# Altium project DC_DC_Converter_FPMI_Lab.PrjPcb
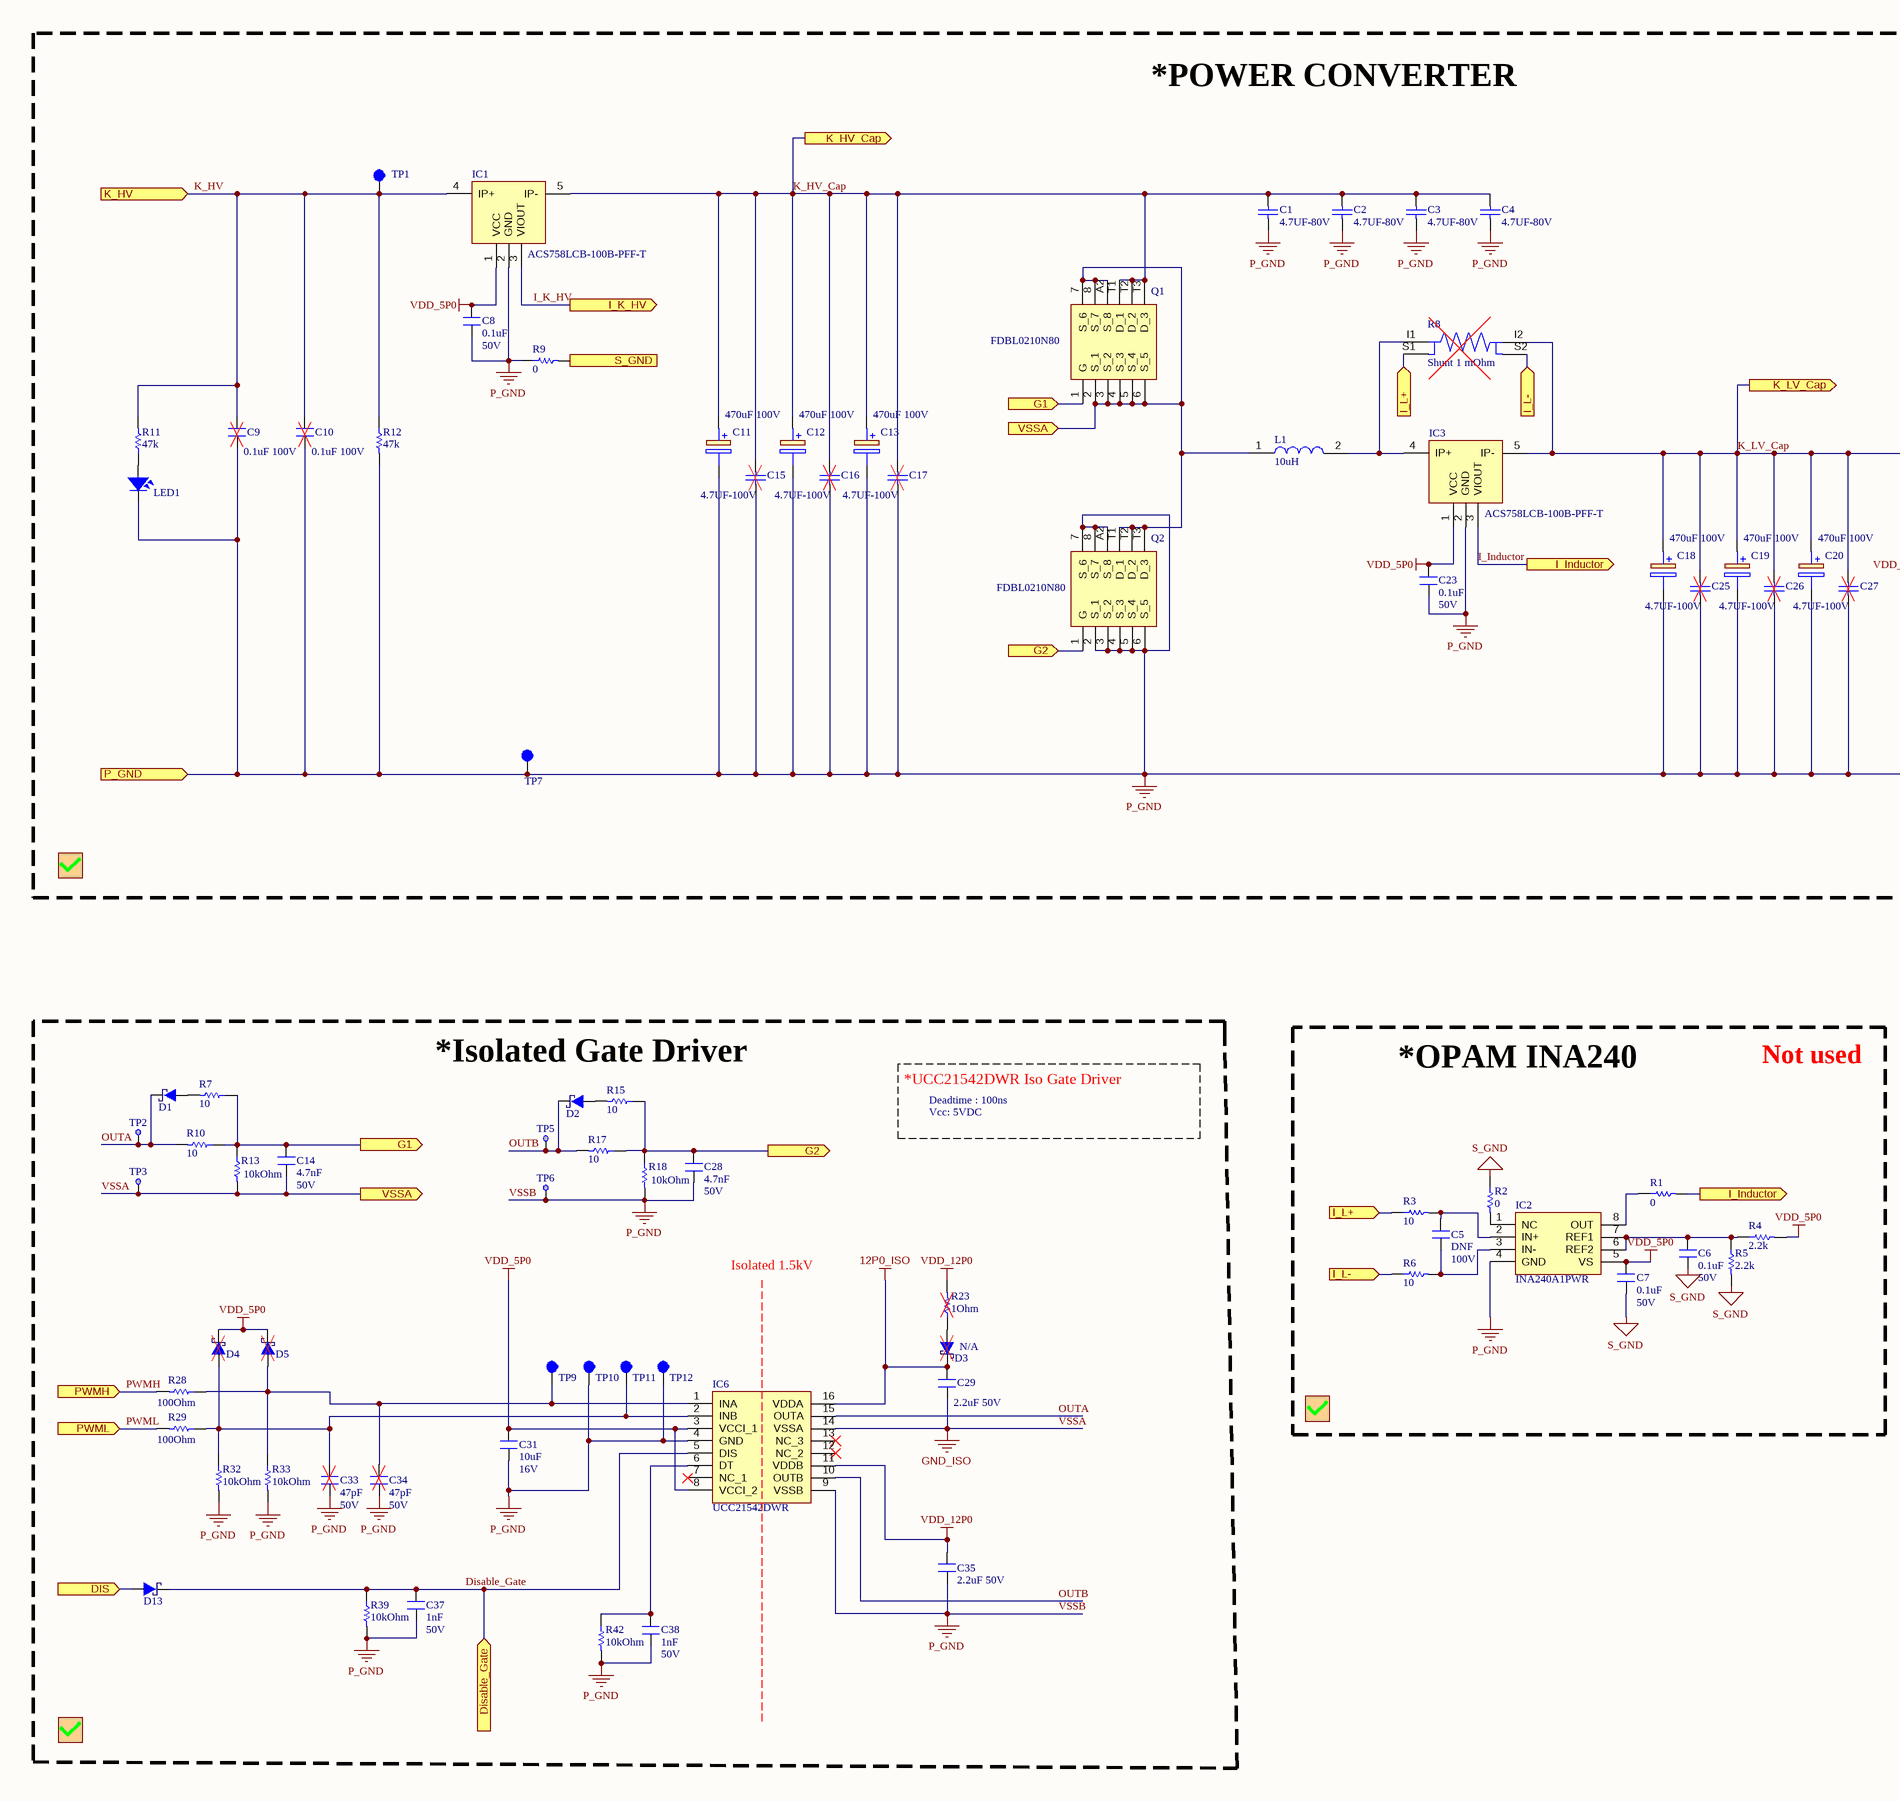
[diagram p0: Power Stages.SchDoc, left]
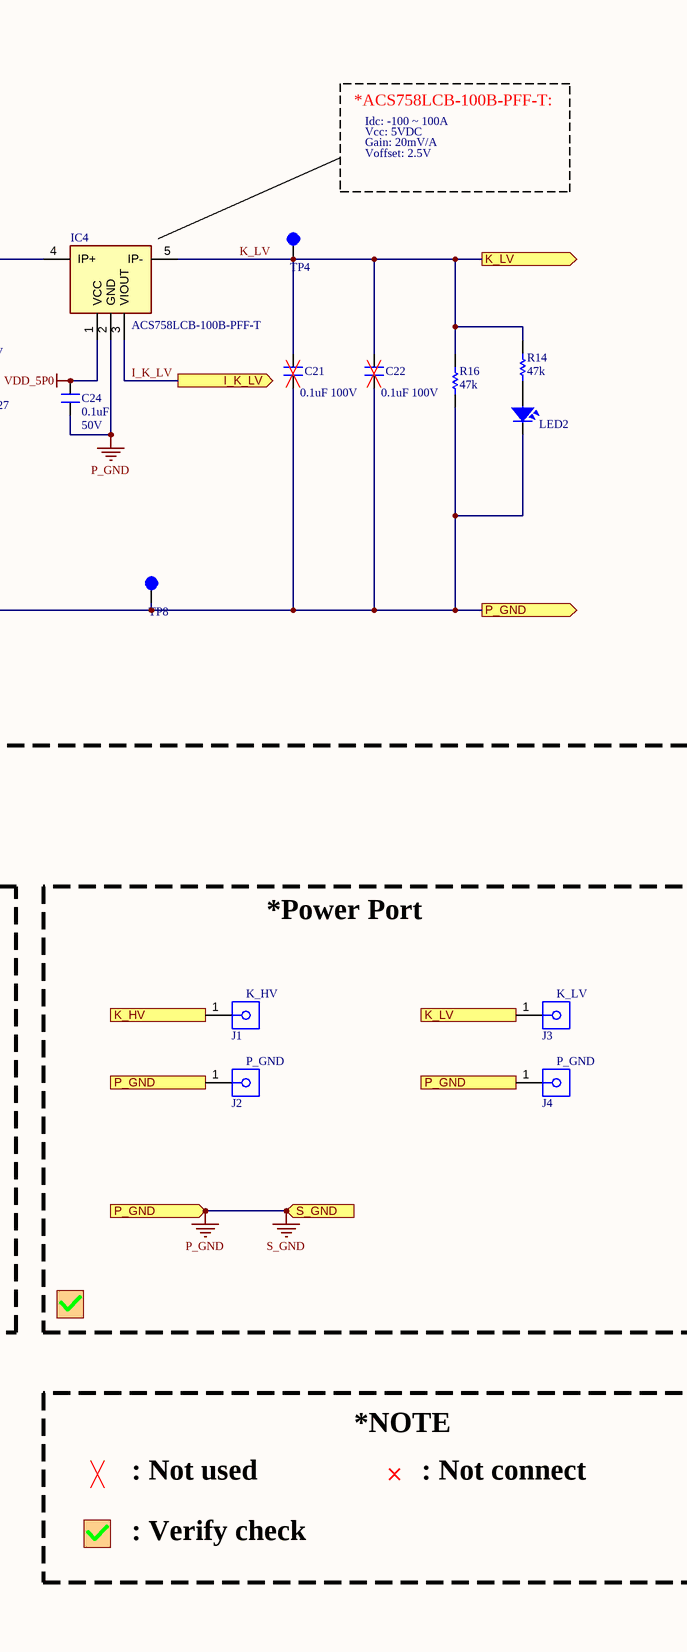
[diagram p1: Power Stages.SchDoc, right]
3 sheets, 200 parts. Net scope: flat (ports and power ports of the same name join across sheets).
Board file: DC_DC_Converter_PCB.PcbDoc
Sheets:
  Power Stages.SchDoc
  Sensor Signal.SchDoc
  Power Supply.SchDoc

## Sheet Power Stages.SchDoc
size A2; SheetNumber: 1; SheetTotal: 3

### Parts
C1  value 4.7UF-80V  [C_1210]  (hidden comment: GRM32ER71K475KE14L)
C2  value 4.7UF-80V  [C_1210]  (hidden comment: GRM32ER71K475KE14L)
C3  value 4.7UF-80V  [C_1210]  (hidden comment: GRM32ER71K475KE14L)
C4  value 4.7UF-80V  [C_1210]  (hidden comment: GRM32ER71K475KE14L)
C5  DNF  value 100V  [C_0603]
C6  0.1uF  value 50V  [C_0603]
C7  0.1uF  value 50V  [C_0603]
C8  0.1uF  value 50V  [C_0603]
C9  0.1uF 100V  [C_1206]
C10  0.1uF 100V  [C_1206]
C11  470uF 100V  [CAP-ALU-13MM*30MM]
C12  470uF 100V  [CAP-ALU-13MM*30MM]
C13  470uF 100V  [CAP-ALU-13MM*30MM]
C14  4.7nF  value 50V  [C_0603]
C15  value 4.7UF-100V  [C_1210]  (hidden comment: GRM32ER71K475KE14L)
C16  value 4.7UF-100V  [C_1210]  (hidden comment: GRM32ER71K475KE14L)
C17  value 4.7UF-100V  [C_1210]  (hidden comment: GRM32ER71K475KE14L)
C18  470uF 100V  [CAP-ALU-13MM*30MM]
C19  470uF 100V  [CAP-ALU-13MM*30MM]
C20  470uF 100V  [CAP-ALU-13MM*30MM]
C21  0.1uF 100V  [C_1206]
C22  0.1uF 100V  [C_1206]
C23  0.1uF  value 50V  [C_0603]
C24  0.1uF  value 50V  [C_0603]
C25  value 4.7UF-100V  [C_1210]  (hidden comment: GRM32ER71K475KE14L)
C26  value 4.7UF-100V  [C_1210]  (hidden comment: GRM32ER71K475KE14L)
C27  value 4.7UF-100V  [C_1210]  (hidden comment: GRM32ER71K475KE14L)
C28  4.7nF  value 50V  [C_0603]
C29  2.2uF 50V  [C_1206]
C31  10uF  value 16V  [C_0805]
C33  47pF  value 50V  [C_0603]
C34  47pF  value 50V  [C_0603]
C35  2.2uF 50V  [C_1206]
C37  1nF  value 50V  [C_0603]
C38  1nF  value 50V  [C_0603]
D1  B0520WS-7-F  [SOD323F]  (value not drawn)
D2  B0520WS-7-F  [SOD323F]  (value not drawn)
D3  PMEG2010AEJ,115  [SOD123]  (value not drawn)
D4  PMEG2010AEJ,115  [SOD323F]  (value not drawn)
D5  PMEG2010AEJ,115  [SOD323F]  (value not drawn)
D13  PMEG2010AEJ,115  [SOD323F]  (value not drawn)
IC1  ACS758LCB-100B-PFF-T  [ACS772ECB200BPFFT]
IC2  INA240A1PWR  [SOP65P640X120-8N]
IC3  ACS758LCB-100B-PFF-T  [ACS772ECB200BPFFT]
IC4  ACS758LCB-100B-PFF-T  [ACS772ECB200BPFFT]
IC6  UCC21542DWR  [SOIC127P1030X265-16N]
J1  K_HV  [HOLE_5mm_RED]
J2  P_GND  [HOLE_5mm_BLACK]
J3  K_LV  [HOLE_5mm_RED]
J4  P_GND  [HOLE_5mm_BLACK]
L1  10uH  [CSCF3218-6R8MC]
LED1  LED SMD  [SM-LED-0805-Blue]  (value not drawn)
LED2  LED SMD  [SM-LED-0805-Blue]  (value not drawn)
Q1  FDBL0210N80  [NTBLS1D5N10MC - duplicate]
Q2  FDBL0210N80  [NTBLS1D5N10MC - duplicate]
R1  0  [R_0603]
R2  0  [R_0603]
R3  10  [R_0603]
R4  2.2k  [R_0603]
R5  2.2k  [R_0603]
R6  10  [R_0603]
R7  10  [R_0805]
R8  Shunt 1 mOhm  [PSG4/PSF4]
R9  value 0  [R_0603]  (hidden comment: 0603)
R10  10  [R_0805]
R11  47k  [R_0603]
R12  47k  [R_1206]
R13  value 10kOhm  [R_0603]  (hidden comment: 0603)
R14  47k  [R_0603]
R15  10  [R_0805]
R16  47k  [R_1206]
R17  10  [R_0805]
R18  value 10kOhm  [R_0603]  (hidden comment: 0603)
R23  value 1Ohm  [R_0603]  (hidden comment: 0603)
R28  value 100Ohm  [R_0603]  (hidden comment: 0603)
R29  value 100Ohm  [R_0603]  (hidden comment: 0603)
R32  value 10kOhm  [R_0603]  (hidden comment: 0603)
R33  value 10kOhm  [R_0603]  (hidden comment: 0603)
R39  value 10kOhm  [R_0603]  (hidden comment: 0603)
R42  value 10kOhm  [R_0603]  (hidden comment: 0603)
TP1  Test Point  [TP_1mm_through_hole]  (value not drawn)
TP2  TP  [TP_1mm]  (value not drawn)  (no BOM)
TP3  TP  [TP_1mm]  (value not drawn)  (no BOM)
TP4  Test Point  [TP_1mm_through_hole]  (value not drawn)
TP5  TP  [TP_1mm]  (value not drawn)  (no BOM)
TP6  TP  [TP_1mm]  (value not drawn)  (no BOM)
TP7  Test Point  [TP_1mm_through_hole]  (value not drawn)
TP8  Test Point  [TP_1mm_through_hole]  (value not drawn)
TP9  Test Point  [TP_1mm_through_hole]  (value not drawn)
TP10  Test Point  [TP_1mm_through_hole]  (value not drawn)
TP11  Test Point  [TP_1mm_through_hole]  (value not drawn)
TP12  Test Point  [TP_1mm_through_hole]  (value not drawn)

### Blocks framed on the sheet
*POWER CONVERTER: C1-C4 C8-C13 C15-C27 IC1 IC3 IC4 L1 LED1 LED2 Q1 Q2 R8 R9 R11 R12 R14 R16 TP1 TP4 TP7 TP8
*Isolated Gate Driver: C14 C28 C29 C31 C33-C35 C37 C38 D1-D5 D13 IC6 R7 R10 R13 R15 R17 R18 R23 R28 R29 R32 R33 R39 R42 TP2 TP3 TP5 TP6 TP9-TP12
*OPAM INA240: C5-C7 IC2 R1-R6
*Power Port: J1-J4

### Ports
DIS (in), Disable_Gate (in), G1 (in), G1 (out), G2 (in), G2 (out), I_Inductor (out), I_K_HV (out), I_K_LV (out), I_L+ (in), I_L- (in), K_HV (in), K_HV_Cap (out), K_LV (in), K_LV (out), K_LV_Cap (out), P_GND (in), P_GND (out), PWMH (in), PWML (in), S_GND (in), S_GND (out), VSSA (in), VSSA (out)

### Nets
12P0_ISO: C29.2 D3.2 IC6.16(VDDA)
VDD_5P0: C7.1 C8.2 C23.2 C24.2 C31.2 D4.2 D5.2 IC1.1(VCC) IC2.5(VS) IC3.1(VCC) IC4.1(VCC) IC6.3(VCCI_1) IC6.8(VCCI_2) R4.1
VDD_12P0: C35.1 IC6.11(VDDB) R23.1
VSSA: C14.1 C29.1 IC6.14(VSSA) L1.1 Q1.2(S_1) Q1.3(S_2) Q1.4(S_3) Q1.5(S_4) Q1.6(S_5) Q1.7(S_6) Q1.8(S_7) Q1.A2(S_8) Q2.T1(D_1) Q2.T2(D_2) Q2.T3(D_3) R13.1 TP3.1(TP) ; port VSSA  [also labelled GND_ISO]
VSSB: C1.1 C2.1 C3.1 C4.1 C6.1 C7.2 C8.1 C9.1 C10.1 C11.2(-) C12.2(-) C13.2(-) C15.1 C16.1 C17.1 C18.2(-) C19.2(-) C20.2(-) C21.1 C22.1 C23.1 C24.1 C25.1 C26.1 C27.1 C28.1 C31.1 C33.2 C34.2 C35.2 C37.1 C38.1 IC1.2(GND) IC2.4(GND) IC3.2(GND) IC4.2(GND) IC6.4(GND) IC6.9(VSSB) J2.1 J4.1 LED1.2 LED2.2 Q2.2(S_1) Q2.3(S_2) Q2.4(S_3) Q2.5(S_4) Q2.6(S_5) Q2.7(S_6) Q2.8(S_7) Q2.A2(S_8) R2.2 R5.1 R9.1 R9.2 R12.1 R16.1 R18.1 R32.1 R33.1 R39.1 R42.1 TP6.1(TP) TP7.1(B) TP8.1(B) TP10.1(B) TP12.1(B) ; port P_GND, port S_GND  [also labelled P_GND, S_GND]
Disable_Gate: C37.2 D13.2 IC6.5(DIS) R39.2 ; port Disable_Gate
I_Inductor: IC3.3(VIOUT) R1.1 ; port I_Inductor
I_K_HV: IC1.3(VIOUT) ; port I_K_HV
I_K_LV: IC4.3(VIOUT) ; port I_K_LV
K_HV: C9.2 C10.2 IC1.4(IP+) J1.1 R11.1 R12.2 TP1.1(B) ; port K_HV
K_HV_Cap: C1.2 C2.2 C3.2 C4.2 C11.1(+) C12.1(+) C13.1(+) C15.2 C16.2 C17.2 IC1.5(IP-) Q1.T1(D_1) Q1.T2(D_2) Q1.T3(D_3) ; port K_HV_Cap
K_LV: C21.2 C22.2 IC4.5(IP-) J3.1 R14.1 R16.2 TP4.1(B) ; port K_LV
K_LV_Cap: C18.1(+) C19.1(+) C20.1(+) C25.2 C26.2 C27.2 IC3.5(IP-) IC4.4(IP+) R8.I2 ; port K_LV_Cap
OUTA: D1.2 IC6.15(OUTA) R10.1 TP2.1(TP)
OUTB: D2.2 IC6.10(OUTB) R17.1 TP5.1(TP)
PWMH: R28.1 ; port PWMH
PWML: R29.1 ; port PWML
NetC5_1: C5.1 IC2.2(IN+) R3.1
NetC5_2: C5.2 IC2.3(IN-) R6.1
NetC6_2: C6.2 IC2.6(REF2) IC2.7(REF1) R4.2 R5.2
NetC14_2: C14.2 Q1.1(G) R7.2 R10.2 R13.2 ; port G1
NetC28_2: C28.2 Q2.1(G) R15.2 R17.2 R18.2 ; port G2
NetC33_1: C33.1 D4.1 IC6.2(INB) R29.2 R32.2 TP11.1(B)
NetC34_1: C34.1 D5.1 IC6.1(INA) R28.2 R33.2 TP9.1(B)
NetC38_2: C38.2 IC6.6(DT) R42.2
NetD1_1: D1.1 R7.1
NetD2_1: D2.1 R15.1
NetD3_1: D3.1 R23.2
NetD13_1: D13.1 ; port DIS
NetIC2_1: IC2.1(NC) R2.1
NetIC2_8: IC2.8(OUT) R1.2
NetIC3_4: IC3.4(IP+) L1.2 R8.I1
NetLED1_1: LED1.1 R11.2
NetLED2_1: LED2.1 R14.2
NetR3_2: R3.2 R8.S1 ; port I_L+
NetR6_2: R6.2 R8.S2 ; port I_L-

Not connected (* = marked no-connect by the designer): IC6 7(NC_1)* 12(NC_2)* 13(NC_3)*

### Notes on the sheet
- *ACS758LCB-100B-PFF-T:
- Idc: -100 ~ 100A
- Voffset: 2.5V
- Gain: 20mV/A
- Vcc: 5VDC
- *UCC21542DWR Iso Gate Driver
- Deadtime : 100ns
- Not used
- Isolated 1.5kV
- (near D3) N/A
- *NOTE
- : Not used
- : Not connect
- : Verify check
- Title:
- Project:
- Power Converter Module
- DC/DC Bidirectional Converter
- Revision:
- CLA Power Electronics
- 36 Xuan Thuy, Dich Vong Hau
- Draw:
- File Name:
- AnhDT
- Check:
- Approve:
- Sheet:
- 1
- Size:
- of
- A2
- Modified Date:
- Cau Giay - Ha Noi
- Time:
- Date:
- ©2023

### Library data of the parts
C1-C4 C15-C17 C25-C27 = Cap 1210: CAP CER 4.7uF 80V X7R 1210; Manufacturer: TDK Corporation; Description std: CAP CER 4.7UF 100V X7S 1210; Category: Capacitors; Part Number: GRM32ER71K475KE14L; Link: https://www.digikey.com/product-detail/en/tdk-corporation/C3225X7S2A475M200AB/445-6043-2-ND/2443521; Digikey Price/1KU: 0.56250; Package: 1210; Digikey Price/1unit: 1.64
C5 = Cap_Cer_0603_1nF: Manufacturer: Murata Electronics; Part Number: GCM188R71E102KA37D; Part Code: S1200-000081; Description SEL: CAP CER 1000PF 25V X7R 0603; Point: 2; Footprint Type: SMD
C6 C7 = Cap_Cer_0603_1nF: CAP CER 0.1UF 50V X7R 0603; Manufacturer: Murata Electronics; Part Number: GCM188R71E102KA37D; Part Code: S1200-000081; Description SEL: CAP CER 1000PF 25V X7R 0603; Point: 2; Footprint Type: SMD
C8 C23 C24 = Cap_Cer_0603_1nF_25V: CAP CER 0.1UF 16V X5R 0603; Manufacturer: Murata Electronics; Part Number: CL21A106KOCLRNC; Part Code: S1200-000082; Description SEL: CAP CER 10UF 16V X5R 0805; Point: 2; Footprint Type: SMD
C9 C10 C21 C22 C29 C35 = Cap_Cer_1206_1uF: Ceramic Capacitor 1206 (+-10% TH)/(+10%SMD); Manufacturer: TDK Corporation; Part Number: C3216X7R2A105K160AA; Part Code: S1200-000129; Description SEL: CAP CER 1UF 100V X7R 1206; Point: 2; Footprint Type: SMD
C11-C13 C18-C20 = 100ZLH470MEFC16X31.5: CAP ALUM 470UF 20% 80V RADIAL; Manufacturer_Name: Panasonic Electronic Components; Part Number: EEU-FS1K471L; Value: 470uF 80V; Height: 33.5mm; Mouser Part Number: EEU-FS1K471L; Mouser Price/Stock: https://www.digikey.com/en/products/detail/panasonic-electronic-components/EEU-FS1K471L/9597020; Arrow Part Number: EEU-FS1K471L; Arrow Price/Stock: https://www.arrow.com/en/products/100zlh470mefc16x31.5/rubycon?region=nac
C14 C28 = Cap_Cer_0603_1nF_25V: CAP CER 0805 4.7NF 50V C0G 5%; Manufacturer: KEMET; Part Number: C0805C472J5GECAUTO; Part Code: S1200-000082; Point: 2; Description SEL: CAP CER 0805 4.7NF 50V C0G 5%; Footprint Type: SMD
C31 = Cap_Cer_0805_10pF: CAP CER 10uF 16V X7R 0805; Manufacturer: Kemet; Part Number: CL21A106KOCLRNC; Part Code: S1200-000116; Point: 2; Description SEL: CAP CER 10uF 16V X7R 0805; Footprint Type: SMD
C33 C34 C37 C38 = Cap_Cer_0603_1nF_25V: CAP CER 1nF 50V X7R 0603; Manufacturer: Murata Electronics; Part Number: GCM188R71E102KA37D; Part Code: S1200-000082; Description SEL: CAP CER 1000PF 25V X7R 0603; Point: 2; Footprint Type: SMD
D1-D3 D13 = PMEG2010AEJ,115: DIODE SCHOTTKY 20V 1A SOD323F; Manufacturer: Nexperia USA Inc.; Current: 1A (DC); Category: DIODE; Part Number: PMEG2010AEJ,115; Footprint/Package: SOD-323F; Footprint type: SMD; Voltage: 20 V
D4 D5 = PMEG2010AEJ,115: DIODE SCHOTTKY 30V 0.2A SOD323F; Manufacturer: Nexperia USA Inc.; Part Number: BAT54HT1G; Current: 0.2A (DC); Voltage: 20 V; Category: DIODE; Footprint/Package: SOD-323F; Footprint type: SMD
IC1 IC3 IC4 = ACS758LCB-100B-PFF-T: Integrated Circuit; Manufacturer_Name: Allegro Microsystems; Datasheet Link: https://www.allegromicro.com/-/media/files/datasheets/acs758-datasheet.ashx; Height: 7.1mm; Manufacturer_Part_Number: ACS758LCB-100B-PFF-T; Mouser Part Number: 250-758LCB100BPFFT; Mouser Price/Stock: https://www.mouser.co.uk/ProductDetail/Allegro-MicroSystems/ACS758LCB-100B-PFF-T?qs=pUKx8fyJudA0WtlqV%2Fcrcw%3D%3D; Arrow Part Number: ACS758LCB-100B-PFF-T; Arrow Price/Stock: https://www.arrow.com/en/products/acs758lcb-100b-pff-t/allegro-microsystems?region=nac
IC2 = INA240A1PWR: Integrated Circuit; Manufacturer_Name: Texas Instruments; Datasheet Link: http://www.ti.com/lit/gpn/INA240; Height: 1.2mm; Manufacturer_Part_Number: INA240A1PWR; Mouser Part Number: 595-INA240A1PWR; Mouser Price/Stock: https://www.mouser.co.uk/ProductDetail/Texas-Instruments/INA240A1PWR?qs=aVyJF2WnouTDXnRi6tpqfA%3D%3D; Arrow Part Number: INA240A1PWR; Arrow Price/Stock: https://www.arrow.com/en/products/ina240a1pwr/texas-instruments?region=nac
IC6 = UCC21542DWR: REINFORCED ISOLATION DUAL-CHANNE; Manufacturer_Name: Texas Instruments; Datasheet Link: https://www.ti.com/lit/ds/symlink/ucc21542.pdf?ts=1623395410745&ref_url=https%253A%252F%252Fwww.ti.com%252Fstore%252Fti%252Fen%252Fp%252Fproduct%252F%253Fp%253DUCC21542DWKR; Height: 2.65mm; Part Number: UCC21542DWR; Mouser Part Number: 595-UCC21542DWR; Mouser Price/Stock: https://www.mouser.co.uk/ProductDetail/Texas-Instruments/UCC21542DWR?qs=DRkmTr78QARxjB5fL7Hhaw%3D%3D
J1-J4 = CONN_1P: Electric Pole 1; Footprint type: TH; Footprint/Package: Nonstandard
L1 = IHDF1300AEEH4R7K10: 10-µH with a specified saturation current of 70-A DC; Height: 15.4mm
LED1 LED2 = LED-SMD-0805: LED BLUE 1/4W 0805
Q1 Q2 = IPLU300N04S4R8XTMA1: MOSFET N-CH 80V 240A 8HPSOF; Manufacturer_Name: Infineon; Height: 2.3mm; Part Number: FDBL0210N80; Mouser Part Number: FDBL0210N80; Arrow Part Number: IPLU300N04S4R8XTMA1
R1 R2 = Resistor_0603_10Ohm 1%: RES 0 OHM 1% 1/8W 0603; Manufacturer: KOA Speer Electronics, Inc.; Part Number: RK73H1JRTTD10R0F; Part Code: S1100-000044; Description SEL: RES 10 OHM 1% 1/8W 0603; Point: 2; Value: 8.2-10kOhm; Footprint Type: SMD; Power: 1/8W; Tolerance: 1%
R3 R6 = Resistor_0603_10Ohm 1%: RES 10 OHM 1% 1/8W 0603; Manufacturer: KOA Speer Electronics, Inc.; Part Number: RK73H1JRTTD10R0F; Part Code: S1100-000044; Point: 2; Description SEL: RES 10 OHM 1% 1/8W 0603; Footprint Type: SMD; Power: 1/8W; Tolerance: 1%
R4 R5 = Resistor_0603_10Ohm 1%: RES 2.2k OHM 1% 1/8W 0603; Manufacturer: KOA Speer Electronics, Inc.; Part Number: RK73H1JRTTD10R0F; Part Code: S1100-000044; Description SEL: RES 10 OHM 1% 1/8W 0603; Point: 2; Footprint Type: SMD; Power: 1/8W; Tolerance: 1%
R7 R10 R15 R17 = Resistor_0805_10Ohm: RES 10 OHM 1% 1/8W 0805; Part Number: RE0805FRE0710RL; Manufacturer: YAGEO; Part Code: S1100-000072; Description SEL: RES SMD 10 OHM 1% 1/8W 0805; Point: 2; Footprint Type: SMD; Power: 1/8W; Tolerance: 1%
R8 = PSG4NTEBL500F: RES 1m OHM 1% 10W NONSTANDARD; Manufacturer: KOA Speer Electronics, Inc.; Value: 1 mOhm; Part Number: PSG4NTEBL500F; Footprint/Package: Nonstandard; Footprint type: SMD; Tolerance: ±1%; Category: Resistor
R9 = Resistor_0603_10kOhm 1%: RES 0 OHM 1% 1/10W 0603; Manufacturer: YAGEO; Part Number: RC0603FR-7W10KL; Part Code: S1100-000043; Description SEL: RES 10K OHM 1% 1/10W 0603; Point: 2; Footprint Type: SMD; Power: 1/10W; Tolerance: 1%
R11 R14 = Resistor_0603_10Ohm 1%: RES 47K OHM 1% 1/10W 0603; Manufacturer: YAGEO; Part Number: RC0603FR-07100KL; Part Code: S1100-000044; Description SEL: RES 10 OHM 1% 1/8W 0603; Point: 2; Power: 1/8W; Footprint Type: SMD; Tolerance: 1%
R12 R16 = Resistor_1206_0Ohm: RES 47K OHM 1/4W 1206; Manufacturer: YAGEO; Part Number: RC1206JR-070RL; Part Code: S1100-000177; Description SEL: RES 0 OHM JUMPER 1/4W 1206; Point: 2; Tolerance: Jumper; Footprint Type: SMD; Power: 1/4W
R13 R18 = Resistor_0603_10kOhm 1%: RES 10K OHM 1% 1/10W 0603; Manufacturer: YAGEO; Part Number: RC0603FR-7W10KL; Part Code: S1100-000043; Point: 2; Description SEL: RES 10K OHM 1% 1/10W 0603; Footprint Type: SMD; Power: 1/10W; Tolerance: 1%
R23 = Resistor_0603_1Ohm: RES 1OHM 1% 1/8W 0603; Manufacturer: Vishay Dale; Part Number: MCT06030C1008FP500; Part Code: S1100-000140; Point: 2; Description SEL: RES 1 OHM 1% 1/8W 0603; Footprint Type: SMD; Power: 1/8W; Tolerance: 1%
R28 R29 = Resistor_0603_100Ohm: RES 100 OHM 1% 1/8W 0603; Manufacturer: KOA Speer Electronics, Inc.; Part Number: RK73H1JRTTD1000F; Part Code: S1100-000052; Point: 2; Description SEL: RES 100 OHM 1% 1/8W 0603; Footprint Type: SMD; Power: 1/8W; Tolerance: 1%
R32 R33 R39 R42 = Resistor_0603_100Ohm: RES 10 kOHM 1% 1/8W 0603; Manufacturer: KOA Speer Electronics, Inc.; Part Number: RK73H1JRTTD1000F; Part Code: S1100-000052; Description SEL: RES 100 OHM 1% 1/8W 0603; Point: 2; Footprint Type: SMD; Power: 1/8W; Tolerance: 1%
TP1 TP4 TP7-TP12 = Test Point: PC TEST POINT COMPACT RED; Part Number: 5005; Manufacturer: Keystone Electronics
TP2 TP3 TP5 TP6 = Test_Point_1mm: Test Point; ComponentLink1Description: New link; ComponentLink1URL: *; ComponentLink2Description: New link; ComponentLink2URL: *; Creator: SELEX MOTORS JSC; Library Ref: Selex_Library

## Sheet Sensor Signal.SchDoc
size A2; SheetNumber: 2; SheetTotal: 3
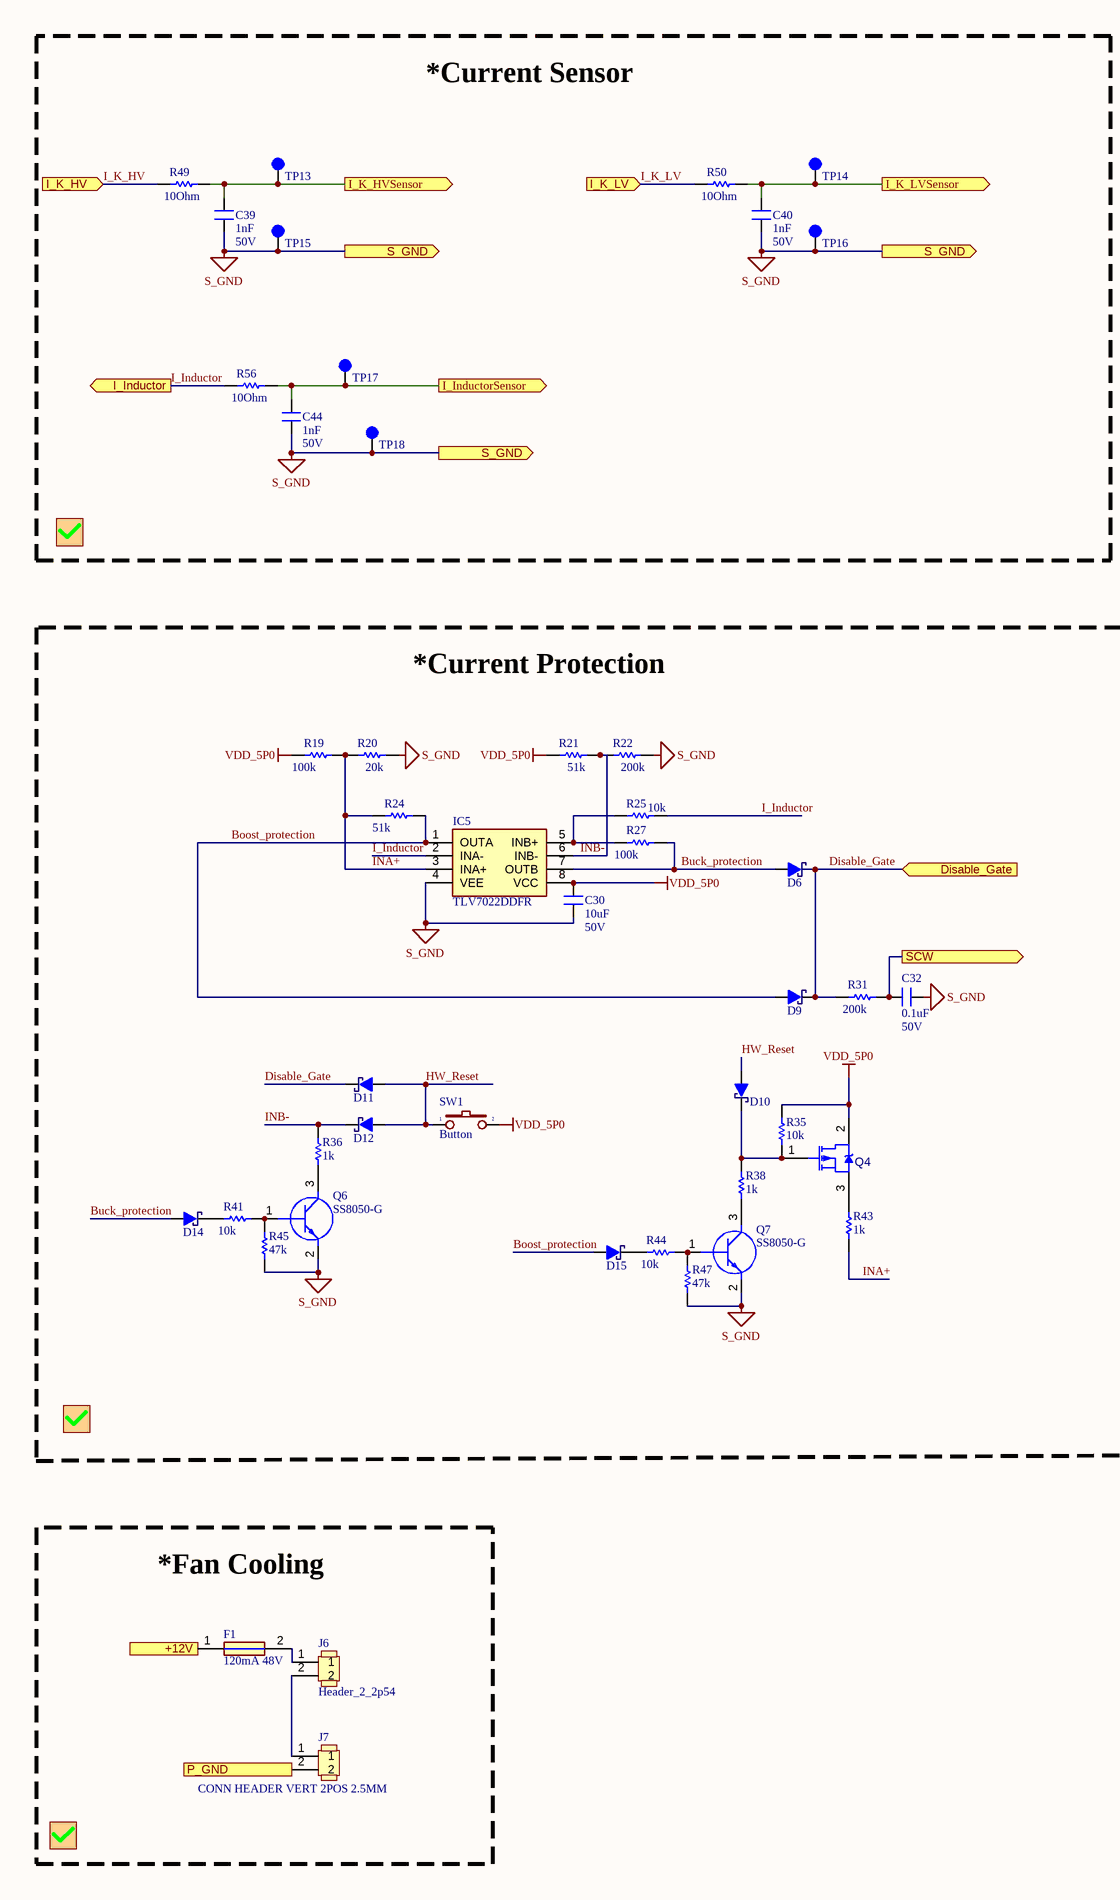
[diagram p2: Sensor Signal.SchDoc, left]
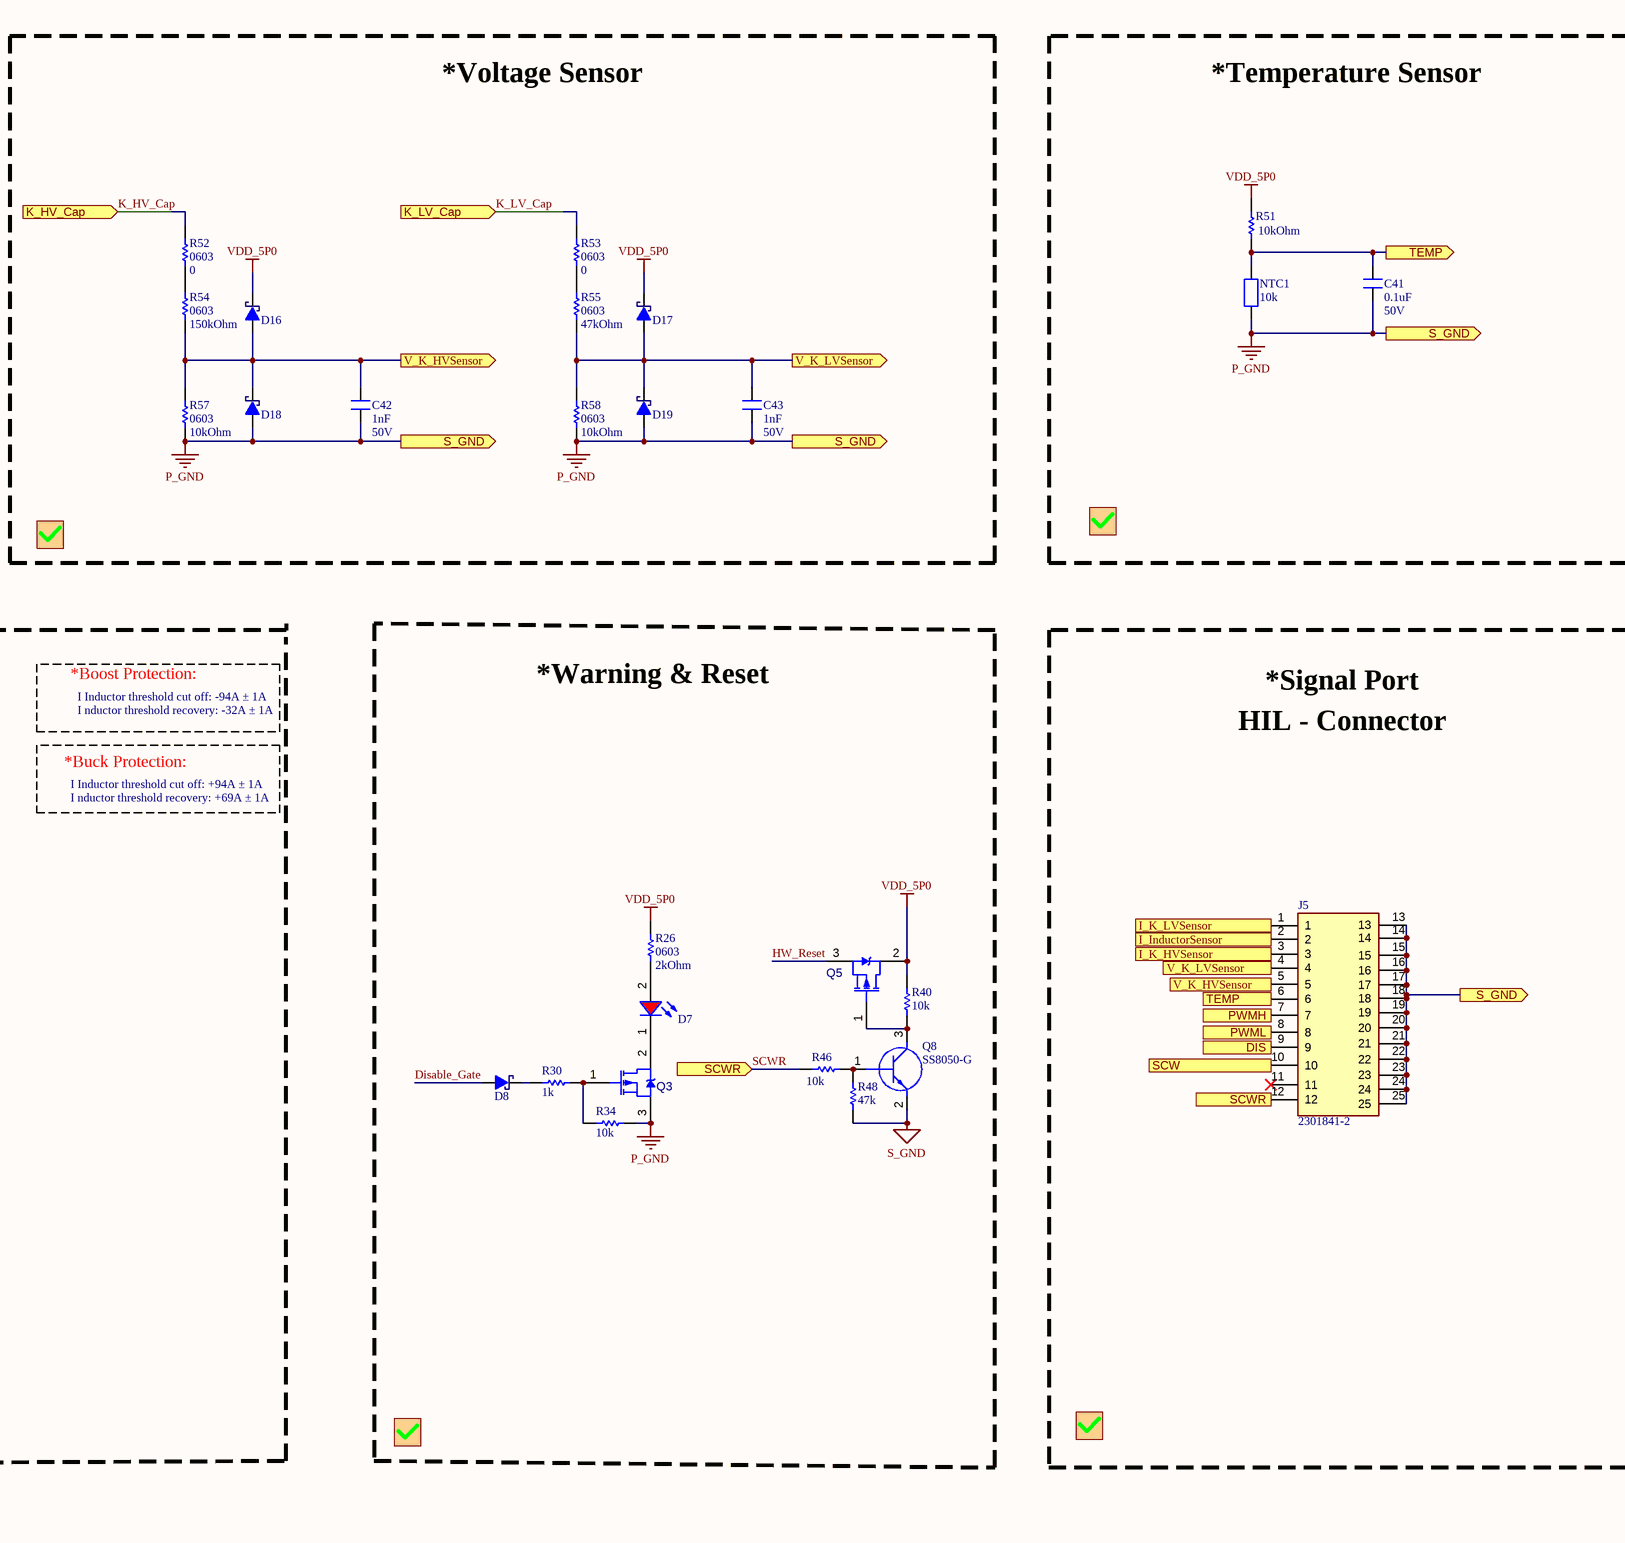
[diagram p3: Sensor Signal.SchDoc, right]

### Parts
C30  10uF  value 50V  [C_0603]
C32  0.1uF  value 50V  [C_0603]
C39  1nF  value 50V  [C_0603]
C40  1nF  value 50V  [C_0603]
C41  0.1uF  value 50V  [C_0603]
C42  1nF  value 50V  [C_0603]
C43  1nF  value 50V  [C_0603]
C44  1nF  value 50V  [C_0603]
D6  PMEG2010AEJ,115  [SOD323F]  (value not drawn)
D7  LED-SMD  [SM-LED-0805-Red]  (value not drawn)
D8  PMEG2010AEJ,115  [SOD323F]  (value not drawn)
D9  PMEG2010AEJ,115  [SOD323F]  (value not drawn)
D10  PMEG2010AEJ,115  [SOD323F]  (value not drawn)
D11  PMEG2010AEJ,115  [SOD323F]  (value not drawn)
D12  PMEG2010AEJ,115  [SOD323F]  (value not drawn)
D14  PMEG2010AEJ,115  [SOD323F]  (value not drawn)
D15  PMEG2010AEJ,115  [SOD323F]  (value not drawn)
D16  PMEG2010AEJ,115  [SOD323F]  (value not drawn)
D17  PMEG2010AEJ,115  [SOD323F]  (value not drawn)
D18  PMEG2010AEJ,115  [SOD323F]  (value not drawn)
D19  PMEG2010AEJ,115  [SOD323F]  (value not drawn)
F1  120mA 48V  [Fuse-SMD-1206]
IC5  TLV7022DDFR  [SOT65P280X110-8N]
J5  2301841-2  [TE_2301841-2]
J6  Header_2_2p54  [JUMP_1x2]
J7  CONN HEADER VERT 2POS 2.5MM  [HEADER_2]
NTC1  10k  [NTC 0805]
Q3  IRLML6402TRPBF  [sot23-3]  (value not drawn)
Q4  IRLML6402TRPBF  [sot23-3]  (value not drawn)
Q5  IRLML6402TRPBF  [sot23-3]  (value not drawn)
Q6  SS8050-G  [sot23-3]
Q7  SS8050-G  [sot23-3]
Q8  SS8050-G  [sot23-3]
R19  value 100k  [R_0603]  (hidden comment: 0603)
R20  value 20k  [R_0603]  (hidden comment: 0603)
R21  51k  [R_0603]
R22  200k  [R_0603]
R24  value 51k  [R_0603]  (hidden comment: 0603)
R25  10k  [R_0603]
R26  0603  value 2kOhm  [R_0603]
R27  value 100k  [R_0603]  (hidden comment: 0603)
R30  1k  [R_0603]
R31  200k  [R_0603]
R34  10k  [R_0603]
R35  10k  [R_0603]
R36  1k  [R_0603]
R38  1k  [R_0603]
R40  10k  [R_0603]
R41  10k  [R_0603]
R43  1k  [R_0603]
R44  10k  [R_0603]
R45  47k  [R_0603]
R46  10k  [R_0603]
R47  47k  [R_0603]
R48  47k  [R_0603]
R49  value 10Ohm  [R_0603]  (hidden comment: 0603)
R50  value 10Ohm  [R_0603]  (hidden comment: 0603)
R51  value 10kOhm  [R_0603]  (hidden comment: 0603)
R52  0603  value 0  [R_0603]
R53  0603  value 0  [R_0603]
R54  0603  value 150kOhm  [R_0603]
R55  0603  value 47kOhm  [R_0603]
R56  value 10Ohm  [R_0603]  (hidden comment: 0603)
R57  0603  value 10kOhm  [R_0603]
R58  0603  value 10kOhm  [R_0603]
SW1  Button  [BUTTON_2P_SMD]
TP13  Test Point  [TP_1mm_through_hole]  (value not drawn)
TP14  Test Point  [TP_1mm_through_hole]  (value not drawn)
TP15  Test Point  [TP_1mm_through_hole]  (value not drawn)
TP16  Test Point  [TP_1mm_through_hole]  (value not drawn)
TP17  Test Point  [TP_1mm_through_hole]  (value not drawn)
TP18  Test Point  [TP_1mm_through_hole]  (value not drawn)

### Blocks framed on the sheet
*Current Sensor: C39 C40 C44 R49 R50 R56 TP13-TP18
*Voltage Sensor: C42 C43 D16-D19 R52-R55 R57 R58
*Temperature Sensor: C41 NTC1 R51
*Warning & Reset: D7 D8 Q3 Q5 Q8 R26 R30 R34 R40 R46 R48
*Fan Cooling: F1 J6 J7

### Ports
+12V (in), DIS (in), Disable_Gate (in), I_Inductor (out), I_InductorSensor (out), I_K_HV (in), I_K_HVSensor (out), I_K_LV (in), I_K_LVSensor (out), K_HV_Cap (in), K_LV_Cap (in), P_GND (in), PWMH (in), PWML (in), S_GND (out), SCW (out), SCWR (in), TEMP (out), V_K_HVSensor (out), V_K_LVSensor (out)

### Nets
P_GND: C30.1 C32.2 C39.1 C40.1 C41.1 C42.1 C43.1 C44.1 D18.1 D19.1 IC5.4(VEE) J5.13 J5.14 J5.15 J5.16 J5.17 J5.18 J5.19 J5.20 J5.21 J5.22 J5.23 J5.24 J5.25 J7.2 NTC1.1 Q3.3(S) Q6.2(E) Q7.2(E) Q8.2(E) R20.2 R22.2 R34.2 R45.1 R47.1 R48.1 R57.1 R58.1 TP15.1(B) TP16.1(B) TP18.1(B) ; port S_GND, port P_GND  [also labelled S_GND]  [project net VSSB]
VDD_5P0: C30.2 D16.2 D17.2 IC5.8(VCC) Q4.2(D) Q5.2(D) R19.1 R21.1 R26.2 R35.2 R40.2 R51.2 SW1.2
VDD_12P0: F1.1 ; port +12V
Boost_protection: D9.1 D15.1 IC5.1(OUTA) R24.2
Buck_protection: D6.1 D14.1 IC5.7(OUTB) R27.2
Disable_Gate: D6.2 D8.1 D9.2 D11.2 R31.1 ; port Disable_Gate
HW_Reset: D10.1 D11.1 D12.1 Q5.3(S) SW1.1
I_Inductor: IC5.2(INA-) R25.2 R56.1 ; port I_Inductor
I_K_HV: R49.1 ; port I_K_HV
I_K_LV: R50.1 ; port I_K_LV
INA+: IC5.3(INA+) R19.2 R20.1 R24.1 R43.1
INB-: D12.2 IC5.6(INB-) R21.2 R22.1 R36.2
K_HV_Cap: R52.2 ; port K_HV_Cap
K_LV_Cap: R53.2 ; port K_LV_Cap
PWMH: J5.7 ; port PWMH
PWML: J5.8 ; port PWML
SCWR: J5.12 R46.1 ; port SCWR
NetC32_1: C32.1 J5.10 R31.2 ; port SCW
NetC39_2: C39.2 J5.3 R49.2 TP13.1(B) ; port I_K_HVSensor
NetC40_2: C40.2 J5.1 R50.2 TP14.1(B) ; port I_K_LVSensor
NetC41_2: C41.2 J5.6 NTC1.2 R51.1 ; port TEMP
NetC42_2: C42.2 D16.1 D18.2 J5.5 R54.1 R57.2 ; port V_K_HVSensor
NetC43_2: C43.2 D17.1 D19.2 J5.4 R55.1 R58.2 ; port V_K_LVSensor
NetC44_2: C44.2 J5.2 R56.2 TP17.1(B) ; port I_InductorSensor
NetD7_1: D7.1(K) Q3.2(D)
NetD7_2: D7.2(A) R26.1
NetD8_2: D8.2 R30.2
NetD10_2: D10.2 Q4.1(G) R35.1 R38.2
NetD13_1: J5.9 ; port DIS
NetD14_2: D14.2 R41.1
NetD15_2: D15.2 R44.1
NetF1_2: F1.2 J6.1
NetIC5_5: IC5.5(INB+) R25.1 R27.1
NetJ6_2: J6.2 J7.1
NetQ3_1: Q3.1(G) R30.1 R34.1
NetQ4_3: Q4.3(S) R43.2
NetQ5_1: Q5.1(G) Q8.3(C) R40.1
NetQ6_1: Q6.1(B) R41.2 R45.2
NetQ6_3: Q6.3(C) R36.1
NetQ7_1: Q7.1(B) R44.2 R47.2
NetQ7_3: Q7.3(C) R38.1
NetQ8_1: Q8.1(B) R46.2 R48.2
NetR52_1: R52.1 R54.2
NetR53_1: R53.1 R55.2

Not connected (* = marked no-connect by the designer): J5 11*

### Notes on the sheet
- *Current Protection
- *Boost Protection:
- I Inductor threshold cut off: -94A ± 1A
- I nductor threshold recovery: -32A ± 1A
- HIL - Connector
- *Signal Port
- *Buck Protection:
- I Inductor threshold cut off: +94A ± 1A
- I nductor threshold recovery: +69A ± 1A
- Title:
- Project:
- Power Converter Module
- DC/DC Bidirectional Converter
- Revision:
- CLA Power Electronics
- 36 Xuan Thuy, Dich Vong Hau
- Draw:
- File Name:
- AnhDT
- Check:
- Approve:
- Sheet:
- 1
- Size:
- of
- A2
- Modified Date:
- Cau Giay - Ha Noi
- Time:
- Date:
- ©2023

### Library data of the parts
C30 = Cap_Cer_0603_1nF_25V: CAP CER 10UF 16V X5R 0805; Manufacturer: Murata Electronics; Part Number: CL21A106KOCLRNC; Part Code: S1200-000082; Point: 2; Description SEL: CAP CER 10UF 16V X5R 0805; Footprint Type: SMD
C32 = Cap_Cer_0603_1nF_25V: as C8 on sheet Power Stages; Footprint Type: SMD
C39 C40 C42-C44 = Cap_Cer_0603_1nF_25V: as C33 on sheet Power Stages; Footprint Type: SMD
C41 = Cap_Cer_0805_10pF: CAP CER 0.1uF 50V X7R 0603; Manufacturer: Kemet; Part Number: CL10C680JB81PNC; Part Code: S1200-000116; Description SEL: CAP CER 68pF 50V C0G 0603; Point: 2; Footprint Type: SMD
D6 D8-D12 D14-D19 = PMEG2010AEJ,115: as D1 on sheet Power Stages; Category: DIODE; Part Number: PMEG2010AEJ,115; Footprint/Package: SOD-323F; Footprint type: SMD; Voltage: 20 V
D7 = LED-SMD: LED RED DIFFUSED 0805 SMD; Manufacturer: OSRAM Opto Semiconductors Inc.; Part Number: LS R976-NR-1; Category: LED; Footprint type: SMD
F1 = Fuse: PTC 120mA 48V 2410; Manufacturer_Name: Bel Circuit Protection; Manufacturer_Part_Number: 0679L1000-01; Datasheet Link: https://belfuse.com/resources/datasheets/circuitprotection/ds-cp-0679l-series.pdf; Height: 2.79mm; Arrow Part Number: 0679L1000-01; Arrow Price/Stock: https://www.arrow.com/en/products/0679l1000-01/bel-group
IC5 = TLV7022DDFR: IC COMPARATOR 2 GEN PUR TSOT23-8; Manufacturer_Name: Texas Instruments; Height: 1.1mm; Part Number: TLV7022DDFR; Mouser Part Number: 595-TLV7022DDFR; Mouser Price/Stock: https://www.mouser.co.uk/ProductDetail/Texas-Instruments/TLV7022DDFR?qs=DPoM0jnrROVunnoIjN7Ztg%3D%3D; Arrow Part Number: TLV7022DDFR; Arrow Price/Stock: https://www.arrow.com/en/products/tlv7022ddfr/texas-instruments?region=nac
J5 = 2301841-2: 25 Position D-Sub Receptacle, Female Sockets Connector; MF: TE Connectivity; Package: None; Value: *; TE_purchase_URL: https://www.te.com/usa-en/product-2301841-2.html?te_bu=Cor&te_type=disp&te_campaign=seda_glo_cor-seda-global-disp-prtnr-fy19-seda-model-bom-cta_sma-317_1&elqCampaignId=32493; Price: None; MP: 2301841-2; SnapEDA_Link: https://www.snapeda.com/parts/2301841-2/TE%20Connectivity%20AMP%20Connectors/view-part/3597269/?ref=snap; Availability: Unavailable
J6 = Header_2_2p54: Part Code: S1900-000020; Point: 2; Manufacturer: *; Part Number: *; Value: *; Description SEL: Header_2_2p54; Footprint Type: TH
J7 = Header_2: Part Code: S1900-000037; Manufacturer: JST Sales America Inc.; Part Number: B2B-XH-A(LF)(SN); Point: 2; Value: Header_2; Description SEL: CONN HEADER VERT 2POS 2.5MM; Footprint Type: TH
NTC1 = NTC 10k 1%: THERMISTOR NTC 10KOHM 3940K 0805; Manufacturer: Vishay Beyschlag/Draloric/BC Components; Part Number: NTCS0805E3103JHT; Part Code: S1100-000169; Point: 2; Power: 1/10W; Tolerance: 0.1%; Description SEL: THERMISTOR NTC 10KOHM 3940K 0805; Footprint Type: SMD
Q3 = S1555-000011: MOSFET N-CH 20V 3.7A; pin to pad: 2>3 3>2; Manufacturer: INFINEON; Part Number: DMP2160U-7; Description SEL: P-Channel 20 V 3.7A (Ta) 1.3W (Ta) Surface Mount Micro3™/SOT-23; Point: 3; Value: 20V 3.7A; Footprint Type: SMD; Part Code: S1555-000011; Packaging: SOT23-3; Component Kind: Standard; Footprint: SOT23-3
Q4 Q5 = S1555-000011: MOSFET P-CH 20V 3.7A; Manufacturer: INFINEON; Description SEL: P-Channel 20 V 3.7A (Ta) 1.3W (Ta) Surface Mount Micro3™/SOT-23; Point: 3; Part Number: IRLML6402; Value: 20V 3.7A; Footprint Type: SMD; Part Code: S1555-000011; Packaging: SOT23-3; Component Kind: Standard; Footprint: SOT23-3
Q6-Q8 = SS8050-G: Transistor BJT NPN; Manufacturer_Name: Comchip Technology; Datasheet Link: https://datasheet.datasheetarchive.com/originals/distributors/DKDS-12/229454.pdf; Height: 1.15mm; Manufacturer_Part_Number: SS8050-G; Mouser Part Number: 750-SS8050-G; Mouser Price/Stock: https://www.mouser.co.uk/ProductDetail/Comchip-Technology/SS8050-G?qs=LLUE9lz1YbcHg%252BWLMAtcrQ%3D%3D; Arrow Part Number: SS8050-G; Arrow Price/Stock: https://www.arrow.com/en/products/ss8050-g/comchip-technology?region=nac
R19 R27 = Resistor_0603_1_MegaOhm_1%: RES 100k OHM 1% 1/10W 0603; Manufacturer: YAGEO; Part Number: RC0603FR-071ML; Part Code: S1100-000171; Description SEL: RES 1M OHM 1% 1/10W 0603; Point: 2; Footprint Type: SMD; Power: 1/10W; Tolerance: 1%
R20 = Resistor_0603_1_MegaOhm_1%: RES 20k OHM 1% 1/10W 0603; Manufacturer: YAGEO; Part Number: RC0603FR-071ML; Part Code: S1100-000171; Description SEL: RES 1M OHM 1% 1/10W 0603; Point: 2; Footprint Type: SMD; Power: 1/10W; Tolerance: 1%
R21 = Resistor_0603_10Ohm 1%: RES 51k OHM 1% 1/8W 0603; Manufacturer: KOA Speer Electronics, Inc.; Part Number: RT0603FRE07300KL; Part Code: S1100-000044; Description SEL: RES 300k OHM 1% 1/8W 0603; Point: 2; Footprint Type: SMD; Power: 1/8W; Tolerance: 1%
R22 = Resistor_0603_10Ohm 1%: RES 200k OHM 1% 1/8W 0603; Manufacturer: KOA Speer Electronics, Inc.; Part Number: RT0603FRE07300KL; Part Code: S1100-000044; Description SEL: RES 300k OHM 1% 1/8W 0603; Point: 2; Footprint Type: SMD; Power: 1/8W; Tolerance: 1%
R24 = Resistor_0603_1_MegaOhm_1%: RES 51k OHM 1% 1/10W 0603; Manufacturer: YAGEO; Part Number: RC0603FR-071ML; Part Code: S1100-000171; Description SEL: RES 1M OHM 1% 1/10W 0603; Point: 2; Footprint Type: SMD; Power: 1/10W; Tolerance: 1%
R25 = Resistor_0603_10Ohm 1%: RES 10k OHM 1% 1/8W 0603; Manufacturer: KOA Speer Electronics, Inc.; Part Number: RNCF0805BTE250K; Part Code: S1100-000044; Description SEL: RES 250k OHM 1% 1/8W 0603; Point: 2; Footprint Type: SMD; Power: 1/8W; Tolerance: 1%
R26 = Resistor_0603_4.7kOhm: RES 2K OHM 1% 1/10W 0603; Manufacturer: YAGEO; Part Number: RC0603FR-074K7L; Part Code: S1100-000158; Description SEL: RES 4.7K OHM 1% 1/10W 0603; Point: 2; Footprint Type: SMD; Power: 1/10W; Tolerance: 1%
R30 R31 R38 R43 = Resistor_0603_10Ohm 1%: RES 200K OHM 1% 1/10W 0603; Manufacturer: YAGEO; Part Number: RC0603FR-13200KL; Part Code: S1100-000044; Point: 2; Power: 1/8W; Description SEL: RES 200K OHM 1% 1/10W 0603; Footprint Type: SMD; Tolerance: 1%
R34 R41 R44 R46 = Resistor_0603_10Ohm 1%: RES 10K OHM 1% 1/10W 0603; Manufacturer: YAGEO; Part Number: RC0603FR-13200KL; Part Code: S1100-000044; Description SEL: RES 200K OHM 1% 1/10W 0603; Point: 2; Power: 1/8W; Footprint Type: SMD; Tolerance: 1%
R35 R40 R45 R47 R48 = Resistor_0603_10Ohm 1%: RES 47K OHM 1% 1/10W 0603; Manufacturer: YAGEO; Part Number: RC0603FR-13200KL; Part Code: S1100-000044; Description SEL: RES 200K OHM 1% 1/10W 0603; Point: 2; Power: 1/8W; Footprint Type: SMD; Tolerance: 1%
R36 = Resistor_0603_10Ohm 1%: RES 1K OHM 1% 1/10W 0603; Manufacturer: YAGEO; Part Number: RC0603FR-13200KL; Part Code: S1100-000044; Description SEL: RES 200K OHM 1% 1/10W 0603; Point: 2; Power: 1/8W; Footprint Type: SMD; Tolerance: 1%
R49 R50 R56 = Resistor_0603_1kOhm: RES 10 OHM 1% 1/10W 0603; Manufacturer: Vishay Dale; Part Number: CRCW06031K00FKTA; Part Code: S1100-000139; Description SEL: RES 1K OHM 1% 1/10W 0603; Point: 2; Footprint Type: SMD; Power: 1/10W; Tolerance: 1%
R51 = Resistor_0603_10kOhm 1%: as R13 on sheet Power Stages; Description SEL: RES 10K OHM 1% 1/10W 0603; Footprint Type: SMD; Power: 1/10W; Tolerance: 1%
R52 R53 = Resistor_0603_220kOhm: RES SMD 0 OHM 1% 1/8W 0603; Manufacturer: Vishay Beyschlag/Draloric/BC Components; Part Number: MCT06030C2203FP500; Part Code: S1100-000053; Description SEL: RES SMD 220K OHM 1% 1/8W 0603; Point: 2; Footprint Type: SMD; Power: 1/8W; Tolerance: 1%
R54 R55 = Resistor_0603_220kOhm: RES SMD 150K OHM 1% 1/8W 0603; Manufacturer: Vishay Beyschlag/Draloric/BC Components; Part Number: MCT06030C2203FP500; Part Code: S1100-000053; Description SEL: RES SMD 220K OHM 1% 1/8W 0603; Point: 2; Footprint Type: SMD; Power: 1/8W; Tolerance: 1%
R57 R58 = Resistor_0603_220kOhm: RES SMD 220K OHM 1% 1/8W 0603; Manufacturer: Vishay Beyschlag/Draloric/BC Components; Part Number: MCT06030C2203FP500; Part Code: S1100-000053; Point: 2; Description SEL: RES SMD 220K OHM 1% 1/8W 0603; Footprint Type: SMD; Power: 1/8W; Tolerance: 1%
SW1 = SW2: Nút nhấn 2 chân dán 3x6x2.5mm; Category: Connector
TP13-TP18 = Test Point: as TP1 on sheet Power Stages

## Sheet Power Supply.SchDoc
size A3; SheetNumber: 3; SheetTotal: 3
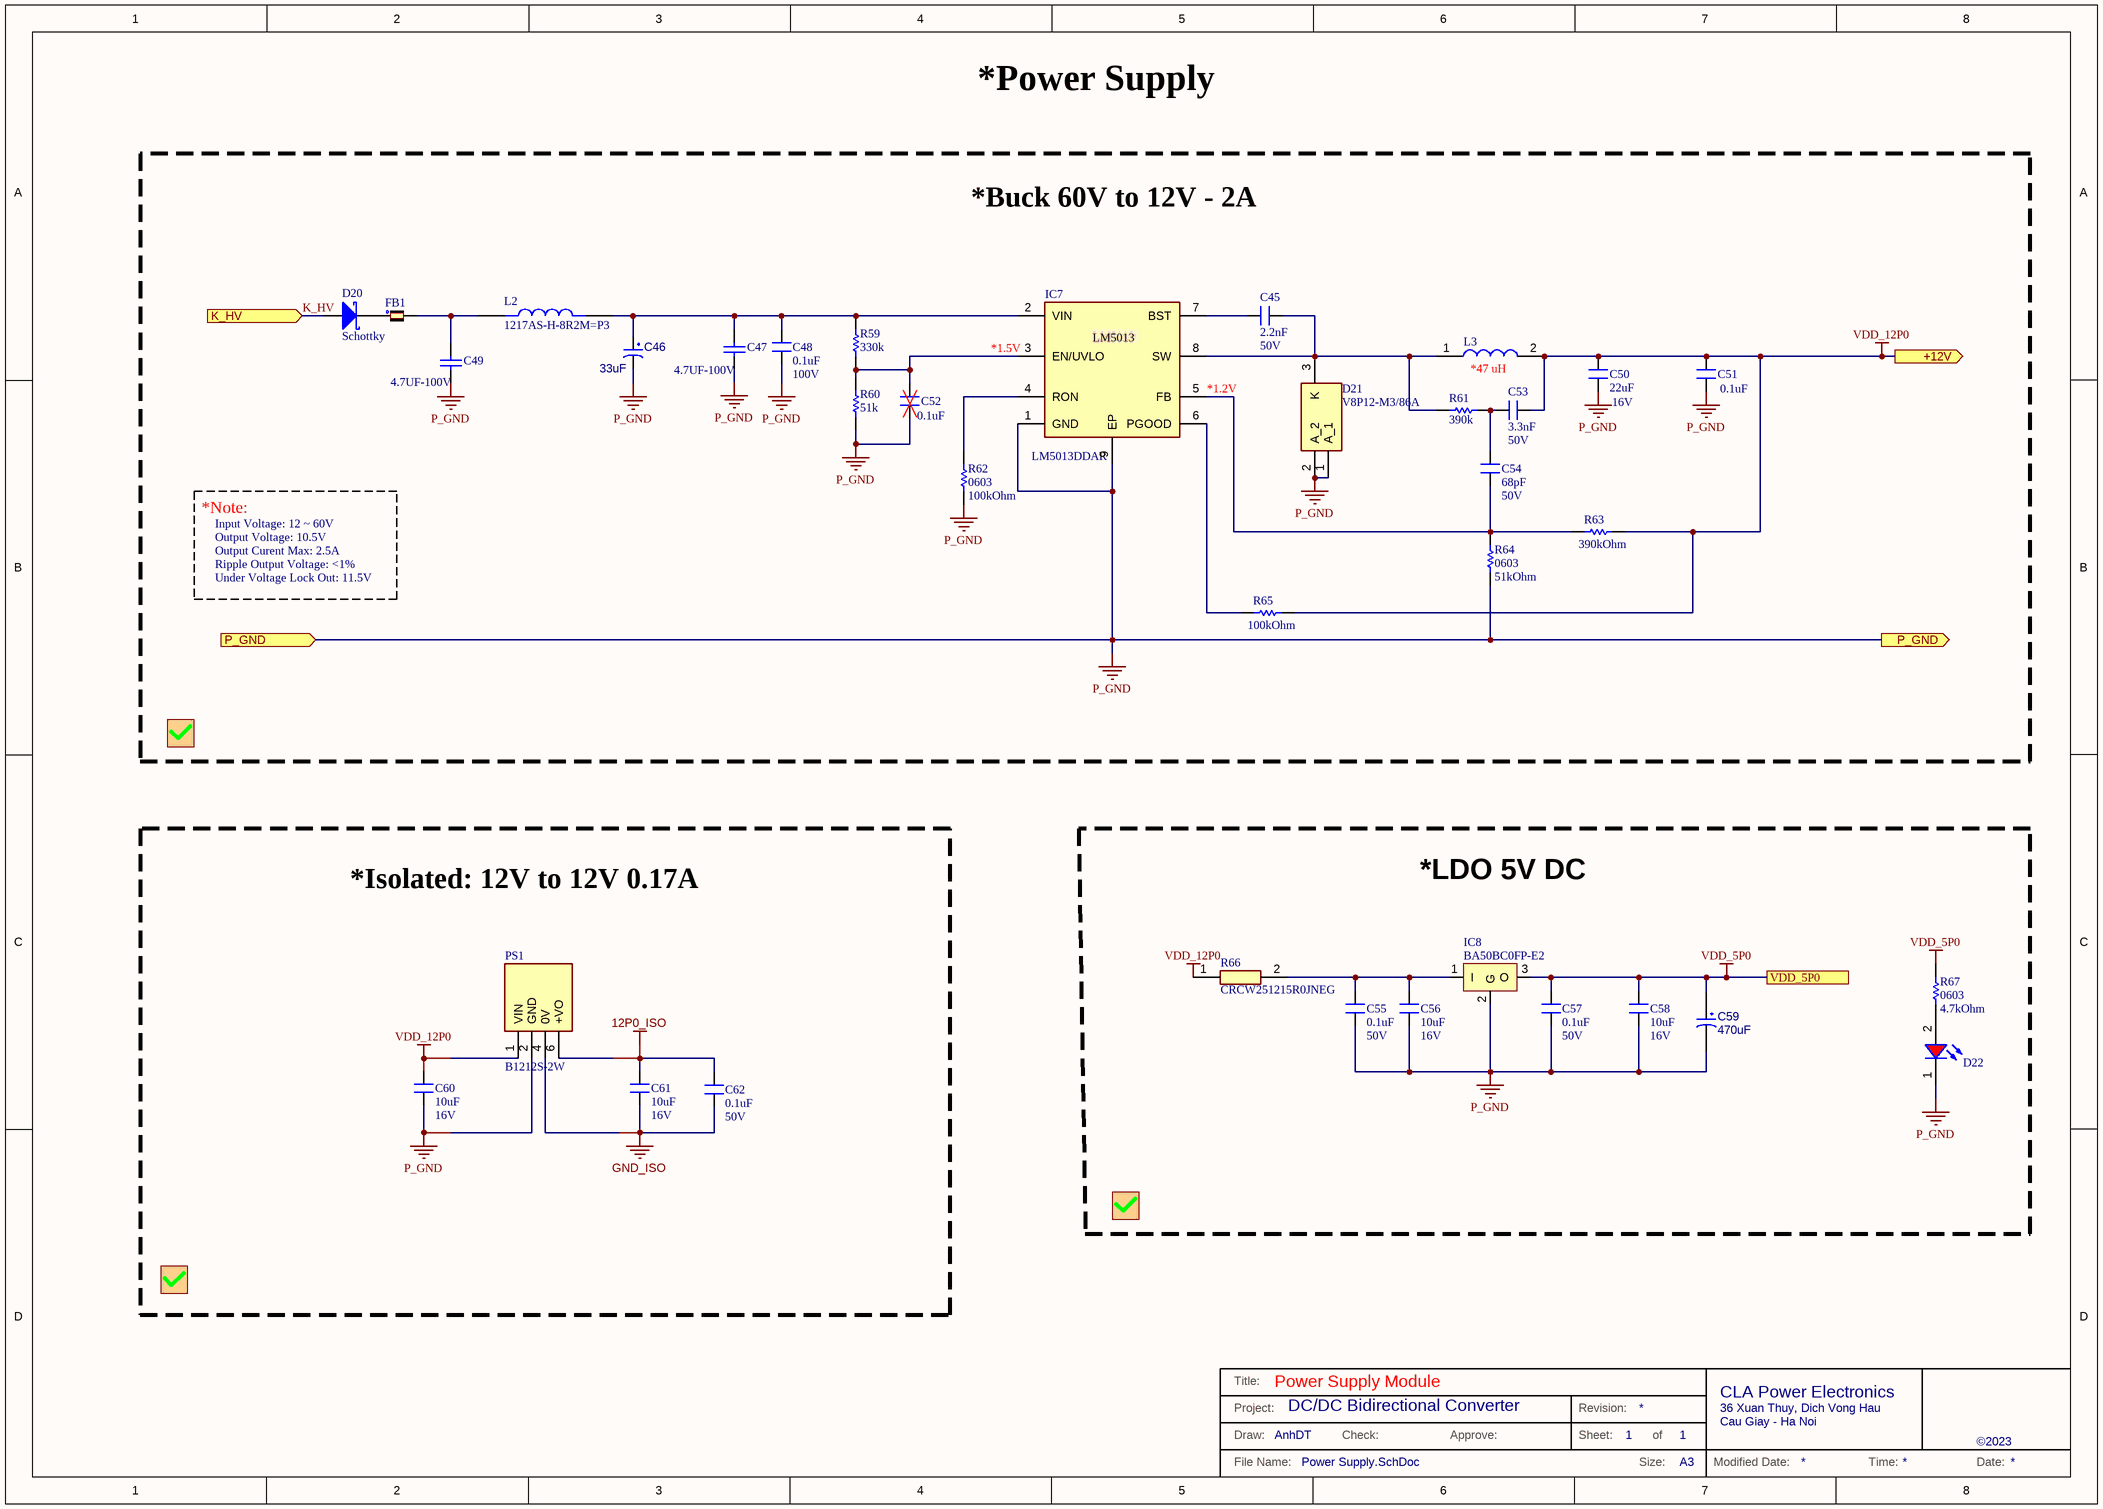
[diagram p4: Power Supply.SchDoc]

### Parts
C45  2.2nF  value 50V  [C_0603]
C46  value 33uF  [C_ALU_TH_8p0D11p5]  (hidden comment: Cap_Alu_TH_8P0D3P5_22uF)
C47  value 4.7UF-100V  [C_1210]  (hidden comment: GRM32ER71K475KE14L)
C48  0.1uF  value 100V  [C_0805]
C49  value 4.7UF-100V  [C_1210]  (hidden comment: GRM32ER71K475KE14L)
C50  22uF  value 16V  [C_1210]
C51  value 0.1uF  [C_0603]  (hidden comment: 0603)
C52  value 0.1uF  [C_0603]  (hidden comment: 0603)
C53  3.3nF  value 50V  [C_0603]
C54  68pF  value 50V  [C_0603]
C55  0.1uF  value 50V  [C_0603]
C56  10uF  value 16V  [C_0805]
C57  0.1uF  value 50V  [C_0603]
C58  10uF  value 16V  [C_0805]
C59  value 470uF  [C_ALU_TH_8p0D11p5]  (hidden comment: Cap_Alu_TH_8P0D3P5)
C60  10uF  value 16V  [C_0805]
C61  10uF  value 16V  [C_0805]
C62  0.1uF  value 50V  [C_0603]
D20  Schottky  [DIODE_Schottky_DO214]
D21  V8P12-M3/86A  [V8P12M386A]
D22  LED-SMD  [SM-LED-0805-Red]  (value not drawn)
FB1  FerriteBead_1206_270Ohm  [FERRITEBEAD_1206]  (value not drawn)
IC7  LM5013DDAR  [SOIC127P600X170-9N]
IC8  BA50BC0FP-E2  [TO252-123]
L2  1217AS-H-8R2M=P3  [IND_1217AS-H-8R2M=P3]
L3  (no value)  [SRR1260A470M]
PS1  B1212S-2W  [B1212S2W]
R59  330k  [R_0603]
R60  51k  [R_0603]
R61  390k  [R_0603]
R62  0603  value 100kOhm  [R_0603]
R63  value 390kOhm  [R_0603]  (hidden comment: 0603)
R64  0603  value 51kOhm  [R_0603]
R65  value 100kOhm  [R_0603]  (hidden comment: 0603)
R66  CRCW251215R0JNEG  [RESC6332X70N]
R67  0603  value 4.7kOhm  [R_0603]

### Blocks framed on the sheet
*Buck 60V to 12V - 2A: C45-C54 D20 D21 FB1 IC7 L2 L3 R59-R65
*Isolated: 12V to 12V 0.17A: C60-C62 PS1
*LDO 5V DC: C55-C59 D22 IC8 R66 R67

### Ports
+12V (out), K_HV (in), P_GND (in), P_GND (out), VDD_5P0

### Nets
12P0_ISO: C61.2 C62.2 PS1.6(+VO)
GND_ISO: C61.1 C62.1 PS1.4(0V)  [project net VSSA]
P_GND: C46.2 C47.1 C48.1 C49.1 C50.1 C51.1 C52.2 C55.1 C56.1 C57.1 C58.1 C59.2 C60.1 D21.1(A_1) D21.2(A_2) D22.1(K) IC7.1(GND) IC7.9(EP) IC8.2(G) PS1.2(GND) R60.1 R62.1 R64.1 ; port P_GND  [project net VSSB]
VDD_5P0: C57.2 C58.2 C59.1 IC8.3(O) R67.2 ; port VDD_5P0
VDD_12P0: C50.2 C51.2 C53.2 C60.2 L3.2 PS1.1(VIN) R63.2 R65.1 R66.1 ; port +12V
K_HV: D20.1(A) ; port K_HV
NetC45_1: C45.1 D21.3(K) IC7.8(SW) L3.1 R61.2
NetC45_2: C45.2 IC7.7(BST)
NetC46_1: C46.1 C47.2 C48.2 IC7.2(VIN) L2.2 R59.2
NetC49_2: C49.2 FB1.2 L2.1
NetC52_1: C52.1 IC7.3(EN/UVLO) R59.1 R60.2
NetC53_1: C53.1 C54.2 R61.1
NetC54_1: C54.1 IC7.5(FB) R63.1 R64.2
NetC55_2: C55.2 C56.2 IC8.1(I) R66.2
NetD20_2: D20.2(K) FB1.1
NetD22_2: D22.2(A) R67.1
NetIC7_4: IC7.4(RON) R62.2
NetIC7_6: IC7.6(PGOOD) R65.2

### Notes on the sheet
- *Power Supply
- (near IC7) *1.5V
- (near IC7) LM5013
- (near L3) *47 uH
- (near IC7) *1.2V
- *Note:
- Output Curent Max: 2.5A
- Under Voltage Lock Out: 11.5V
- Input Voltage: 12 ~ 60V
- Output Voltage: 10.5V
- Ripple Output Voltage: <1%
- Title:
- Power Supply Module
- CLA Power Electronics
- Project:
- Draw:
- AnhDT
- DC/DC Bidirectional Converter
- Check:
- Approve:
- Revision:
- Sheet:
- 1
- of
- 36 Xuan Thuy, Dich Vong Hau
- Cau Giay - Ha Noi
- ©2023
- File Name:
- Size:
- A3
- Modified Date:
- Time:
- Date:
- (in symbol LM5012DDAR) LM5012

### Library data of the parts
C45 = Cap_Cer_0805_10pF: CAP CER 2.2nF 50V X7R 0805; Manufacturer: Samsung Electro-Mechanics; Part Number: C0805C222J5GEC7800; Part Code: S1200-000116; Description SEL: CAP CER 2.2nF 50V X7R 0603; Point: 2; Footprint Type: SMD
C46 = S1200-000209: CAP ALUM 33UF 20% 80V RADIAL; Manufacturer: PANASONIC; Part Number: 80ZLH33MEFC6.3X11; Point: 2; Description SEL: CAP ALUM 33UF 20% 80V RADIAL; Footprint Type: TH; Part Code: S1200-000209; Component Kind: Standard
C47 C49 = Cap 1210: as C1 on sheet Power Stages; Category: Capacitors; Part Number: GRM32ER71K475KE14L; Link: https://www.digikey.com/product-detail/en/tdk-corporation/C3225X7S2A475M200AB/445-6043-2-ND/2443521; Digikey Price/1KU: 0.56250; Package: 1210; Digikey Price/1unit: 1.64
C48 = Cap_Cer_0805_10pF: CAP CER 0.1uF 100V X7R 0805; Manufacturer: Samsung Electro-Mechanics; Part Code: S1200-000116; Point: 2; Footprint Type: SMD
C50 = Cap_Cer_0805_10pF: CAP CER 22uF 16V X7R 1210; Manufacturer: Samsung Electro-Mechanics; Part Number: CL32A226KOJNNNE; Part Code: S1200-000116; Point: 2; Description SEL: CAP CER 22uF 16V X7R 1210; Footprint Type: SMD
C51 = Cap_Cer_0603_0.1uF_25V: CAP CER 0.1UF 25V X8R 0603; Manufacturer: Murata Electronics; Part Number: GCM188R91E104KA37J; Part Code: S1200-000077; Point: 2; Description SEL: CAP CER 0.1UF 25V X8R 0603; Footprint Type: SMD
C52 = Cap_Cer_0603_0.1uF_100V: CAP CER 0.1UF 100V X7R 0603; Manufacturer: Murata Electronics; Part Number: GRM188R72A104KA35D; Part Code: S1200-000079; Point: 2; Description SEL: CAP CER 0.1UF 100V X7R 0603; Footprint Type: SMD
C53 = Cap_Cer_0805_10pF: CAP CER 0805 3.3NF 50V C0G 1%; Manufacturer: Kemet; Part Number: C0805C332F5GECAUTO; Part Code: S1200-000116; Description SEL: 10pF 50VDC; Point: 2; Footprint Type: SMD
C54 = Cap_Cer_0805_10pF: CAP CER 68pF 50V C0G 0603; Manufacturer: Kemet; Part Number: CL10C680JB81PNC; Part Code: S1200-000116; Point: 2; Description SEL: CAP CER 68pF 50V C0G 0603; Footprint Type: SMD
C55 C57 C62 = Cap_Cer_0805_10pF: as C41 on sheet Sensor Signal; Footprint Type: SMD
C56 C58 = Cap_Cer_0805_10pF: as C31 on sheet Power Stages; Description SEL: CAP CER 10uF 16V X7R 0805; Footprint Type: SMD
C59 = S1200-000039: CAP ALUM 470UF 20% 25V RADIAL; Manufacturer: Rubycon; Part Number: 16YXJ220MT16.3X11; Point: 2; Description SEL: CAP ALUM 470UF 20% 25V RADIAL; Footprint Type: TH; Part Code: S1200-000039; Component Kind: Standard
C60 = Cap_Cer_0805_10pF: CAP CER 2.2uF 50V X7R 0805; Manufacturer: Samsung Electro-Mechanics; Part Number: CL31B225KBHNNNE; Part Code: S1200-000116; Description SEL: 10pF 50VDC; Point: 2; Footprint Type: SMD
C61 = Cap_Cer_0805_10pF: CAP CER 4.7uF 50V X7R 0805; Manufacturer: Samsung Electro-Mechanics; Part Number: CL31B225KBHNNNE; Part Code: S1200-000116; Description SEL: 10pF 50VDC; Point: 2; Footprint Type: SMD
D20 = SS34: DIODE SCHOTTKY 100V 3A SMA; Manufacturer: SMC Diode Solutions; Part Number: SS310; Part Code: S1500-000030; Value: 3A 100V; Point: 2; Description SEL: DIODE SCHOTTKY 100V 3A SMA; Footprint Type: SMA; Packaging: DIODE_Schottky_DO214
D21 = V8P12-M3_86A: DIODE SCHOTTKY 120V 8A TO277A; Manufacturer_Name: Vishay; Datasheet Link: https://www.vishay.com/docs/89170/v8p12.pdf; Height: 1.2mm; Part Number: V8P12-M3/86A; Mouser Part Number: 78-V8P12-M3/86A; Mouser Price/Stock: https://www.mouser.co.uk/ProductDetail/Vishay-General-Semiconductor/V8P12-M3-86A?qs=HSPD0Bff7iYR%2FGS73JOLOg%3D%3D; Arrow Part Number: V8P12-M3/86A; Arrow Price/Stock: https://www.arrow.com/en/products/v8p12-m386a/vishay?region=nac
D22 = LED-SMD: as D7 on sheet Sensor Signal; Category: LED; Footprint type: SMD
FB1 = FerriteBead_1206_270Ohm: FERRITE BEAD 270 OHM 1206 1LN; Manufacturer: Murata Electronics; Part Number: BLM31KN271SH1L; Part Code: S1100-000016; Point: 2; Value: 270Ohm; Description SEL: FERRITE BEAD 270 OHM 1206 1LN; Footprint Type: SMD
IC7 = LM5012DDAR: IC REG BUCK ADJ 3.5A 8SO PWR; Part Number: LM5013DDAR
IC8 = BA50BC0FP-E2: IC REG LINEAR 5V 1A TO252-2; Manufacture: Rohm Semiconductor; ComponentLink1Description: Manufacturer Link; ComponentLink1URL: http://www.st.com/; ComponentLink2Description: Datasheet; ComponentLink2URL: http://www.st.com/stonline/products/literature/ds/2146/l78m05c.pdf; Footprint type: SMD; Category: IC; Part Number: BA50BC0FP-E2
L2 = 1217AS-H-8R2M=P3: Inductor with Inductance: 8.2uH Tol. +/-20%, Package: 3131 (8080); MF: Murata; Price: None; Value: *; Arrow_Electronics-Purchase-URL: https://snapeda.com/shop?store=Arrow+Electronics&id=4547222; MP: 1217AS-H-8R2M=P3; Package: NONSTANDARD; SnapEDA_Link: https://www.snapeda.com/parts/1217AS-H-8R2M=P3/Murata/view-part/4547222/?ref=snap; Mouser-Purchase-URL: https://snapeda.com/shop?store=Mouser&id=4547222; Availability: Warning
L3 = Inductor: FIXED IND 47UH 2.5A 100 MOHM SMD; Manufacturer: Taiyo Yuden; Part Number: CDRH127-470; Footprint: Nonstandard; Footprint type: SMD; Category: Inductor
PS1 = B1212S-2W: Power Supply; Manufacturer_Name: Mornsun Power; Datasheet Link: https://www.mornsun-power.com/public/uploads/pdf/B_S-2WR3.pdf; Height: 10.41mm; Manufacturer_Part_Number: B1212S-2W
R59 = Resistor_0603_10Ohm 1%: as R30 on sheet Sensor Signal; Description SEL: RES 200K OHM 1% 1/10W 0603; Footprint Type: SMD; Tolerance: 1%
R60 = Resistor_0603_10Ohm 1%: RES 24k OHM 1% 1/8W 0603; Manufacturer: YAGEO; Part Number: RC0603FR-1024KL; Part Code: S1100-000044; Description SEL: RES 24K OHM 1% 1/10W 0603; Point: 2; Value: 8.2-10kOhm; Footprint Type: SMD; Power: 1/8W; Tolerance: 1%
R61 = Resistor_0603_10Ohm 1%: RES 390k OHM 1% 1/8W 0603; Manufacturer: YAGEO; Part Number: RC0603FR-07390KL; Part Code: S1100-000044; Description SEL: RES 390K OHM 1% 1/10W 0603; Point: 2; Footprint Type: SMD; Power: 1/8W; Tolerance: 1%
R62 R65 = Resistor_0603_100kOhm: RES SMD 100K OHM 1% 1/8W 0603; Manufacturer: Vishay Beyschlag/Draloric/BC Components; Part Number: MCT06030C1003FP500; Part Code: S1100-000051; Point: 2; Description SEL: RES SMD 100K OHM 1% 1/8W 0603; Footprint Type: SMD; Power: 1/8W; Tolerance: 1%
R63 = Resistor_0603_470kOhm: RES SMD 470K OHM 1% 1/10W 0603; Manufacturer: Walsin Technology Corporation; Part Code: S1100-000056; Point: 2; Description SEL: RES SMD 470K OHM 1% 1/10W 0603; Footprint Type: SMD; Power: 1/10W; Tolerance: 1%
R64 = Resistor_0603_51kOhm: RES SMD 51K OHM 1% 1/8W 0603; Manufacturer: YAGEO; Part Number: RC0603FR-0751KL; Part Code: S1100-000148; Point: 2; Description SEL: RES SMD 51K OHM 1% 1/8W 0603; Footprint Type: SMD; Power: 1/8W; Tolerance: 1%
R66 = CRCW251215R0JNEG: Manufacturer_Name: Vishay; Datasheet Link: http://www.vishay.com/docs/20035/dcrcwe3.pdf; Height: 0.7mm; Part Number: CRCW251215R0JNEG; Mouser Part Number: 71-CRCW2512J-15-E3; Mouser Price/Stock: https://www.mouser.co.uk/ProductDetail/Vishay-Dale/CRCW251215R0JNEG?qs=Z1AZHWO%2FsqLBwgjNhUTIZA%3D%3D; Arrow Part Number: CRCW251215R0JNEG; Arrow Price/Stock: https://www.arrow.com/en/products/crcw251215r0jneg/vishay
R67 = Resistor_0603_4.7kOhm: as R26 on sheet Sensor Signal; Footprint Type: SMD; Power: 1/10W; Tolerance: 1%

## Nets that join several sheets
12P0_ISO: Power Stages (C29.2 D3.2 IC6.16), Power Supply (C61.2 C62.2 PS1.6)
VDD_5P0: Power Stages (14 pins), Sensor Signal (13 pins), Power Supply (5 pins)
VDD_12P0: Power Stages (C35.1 IC6.11 R23.1), Sensor Signal (F1.1), Power Supply (9 pins)
VSSA: Power Stages (17 pins), Power Supply (C61.1 C62.1 PS1.4)
VSSB: Power Stages (66 pins), Sensor Signal (41 pins), Power Supply (23 pins)
Disable_Gate: Power Stages (C37.2 D13.2 IC6.5 R39.2), Sensor Signal (5 pins)
I_Inductor: Power Stages (IC3.3 R1.1), Sensor Signal (IC5.2 R25.2 R56.1)
I_K_HV: Power Stages (IC1.3), Sensor Signal (R49.1)
I_K_LV: Power Stages (IC4.3), Sensor Signal (R50.1)
K_HV: Power Stages (7 pins), Power Supply (D20.1)
K_HV_Cap: Power Stages (14 pins), Sensor Signal (R52.2)
K_LV_Cap: Power Stages (9 pins), Sensor Signal (R53.2)
NetD13_1: Power Stages (D13.1), Sensor Signal (J5.9)
PWMH: Power Stages (R28.1), Sensor Signal (J5.7)
PWML: Power Stages (R29.1), Sensor Signal (J5.8)